# Altium schematic sheet ARDUINO.SchDoc: Arduino UNO connectors
size A4; Author: N.P; CompanyName: STMicroelectronics; Organization: MCD/APPLIS/LMS; DocumentNumber: MB1260; SheetNumber: 12; SheetTotal: 13; Project: STM32F723e-DISCO
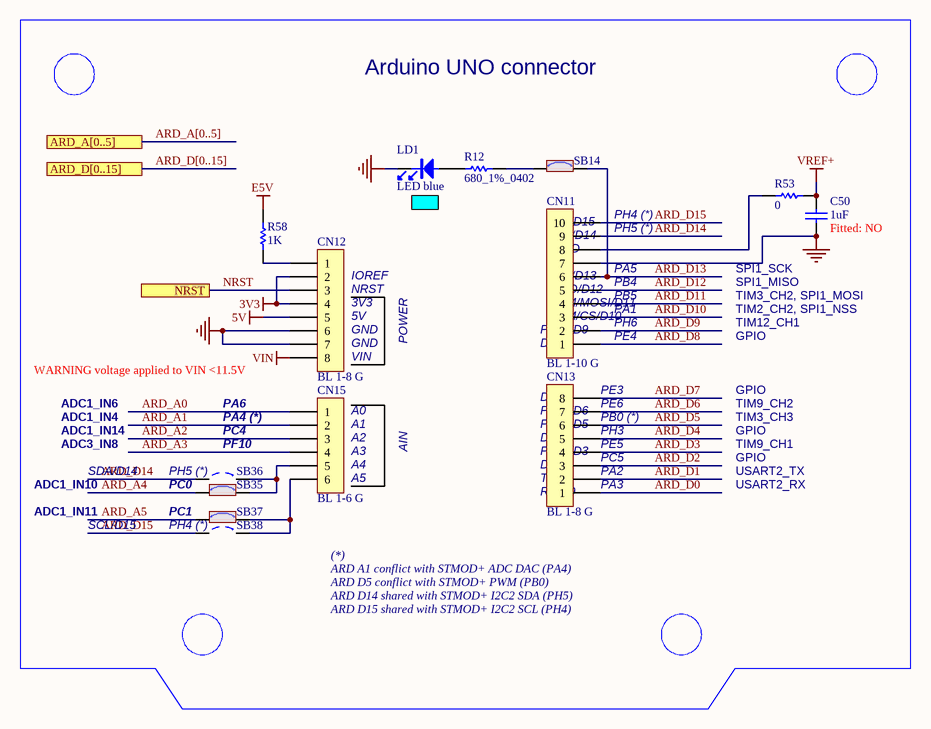
[diagram p0: ARDUINO.SchDoc]

## Parts
C50  1uF  Fitted: NO  [0603C]
CN11  BL 1-10 G  [HDR_1X10_2R54_W]
CN12  BL 1-8 G  [HDR_1X8_2R54_W]
CN13  BL 1-8 G  [HDR_1X8_2R54_W]
CN15  BL 1-6 G  [HDR_1X6_2R54_W]
LD1  LED blue  [0603D]
R12  680_1%_0402  [0402R]
R53  0  [0402R]
R58  1K  [0402R]
SB14  Solder Bridge ON  [JP2_SMD]  (value not drawn)
SB35  Solder Bridge ON  [JP2_SMD]  (value not drawn)
SB36  Solder Bridge OFF  [JP2_SMD]  (value not drawn)
SB37  Solder Bridge ON  [JP2_SMD]  (value not drawn)
SB38  Solder Bridge OFF  [JP2_SMD]  (value not drawn)

## Ports
ARD_A[0..5], ARD_D[0..15], NRST

## Nets
3V3: CN12.2 CN12.4
5V: CN12.5
E5V: R58.2
GND: C50.1 CN11.7 CN12.6 CN12.7 LD1.2
VIN: CN12.8
VREF+: C50.2 R53.2
ARD_A0: CN15.1
ARD_A1: CN15.2
ARD_A2: CN15.3
ARD_A3: CN15.4
ARD_A4: SB35.1
ARD_A5: SB37.1
ARD_D0: CN13.1
ARD_D1: CN13.2
ARD_D2: CN13.3
ARD_D3: CN13.4
ARD_D4: CN13.5
ARD_D5: CN13.6
ARD_D6: CN13.7
ARD_D7: CN13.8
ARD_D8: CN11.1
ARD_D9: CN11.2
ARD_D10: CN11.3
ARD_D11: CN11.4
ARD_D12: CN11.5
ARD_D13: CN11.6 SB14.2
ARD_D14: CN11.9 SB36.1
ARD_D15: CN11.10 SB38.1
NRST: CN12.3 ; port NRST
NetCN11_8: CN11.8 R53.1
NetCN12_1: CN12.1 R58.1
NetCN15_5: CN15.5 SB35.2 SB36.2
NetCN15_6: CN15.6 SB37.2 SB38.2
NetLD1_1: LD1.1 R12.1
NetR12_2: R12.2 SB14.1

## Buses and harness runs
bus ARD_A[0..5] = port ARD_A[0..5]
bus ARD_D[0..15] = port ARD_D[0..15]

## Notes on the sheet
- Arduino UNO connector
- PH4 (*)
- (near CN12) IOREF
- (near CN12) NRST
- (near CN11) SDA/D14
- (near CN11) SCL/D15
- (near CN11) SCK/D13
- (near CN11) MISO/D12
- (near CN11) AVDD
- (near CN11) GND
- (near CN11) PB4
- (near CN11) PA5
- (near CN11) PH5 (*)
- SPI1_MISO
- SPI1_SCK
- (near CN12) 3V3
- (near CN12) 5V
- (near CN12) GND
- POWER
- (near CN11) D8
- (near CN11) PWM/D9
- (near CN11) PWM/CS/D10
- (near CN11) PWM/MOSI/D11
- (near CN11) PA1
- (near CN11) PE4
- (near CN11) PH6
- (near CN11) PB5
- TIM12_CH1
- TIM2_CH2, SPI1_NSS
- TIM3_CH2, SPI1_MOSI
- GPIO
- WARNING voltage applied to VIN <11.5V
- ADC1_IN4
- ADC1_IN6
- PA6
- PA4 (*)
- (near CN15) A0
- (near CN15) A1
- (near CN12) VIN
- (near CN13) PWM/D5
- (near CN13) PWM/D6
- (near CN13) D7
- (near CN13) PE6
- (near CN13) PE3
- (near CN13) PB0 (*)
- TIM3_CH3
- TIM9_CH2
- ADC1_IN10
- ADC3_IN8
- ADC1_IN14
- SDA/D14
- (near SB36) PH5 (*)
- PC0
- PC4
- PF10
- (near CN15) A2
- (near CN15) A3
- (near CN15) A4
- (near CN15) A5
- AIN
- (near CN13) TX/D1
- (near CN13) D2
- (near CN13) D4
- (near CN13) PWM/D3
- (near CN13) PA2
- (near CN13) PC5
- (near CN13) PE5
- (near CN13) PH3
- (near CN13) PA3
- USART2_RX
- USART2_TX
- TIM9_CH1
- ADC1_IN11
- SCL/D15
- PC1
- (near CN13) RX/D0
- (*)
  ARD A1 conflict with STMOD+ ADC DAC (PA4)
  ARD D5 conflict with STMOD+ PWM (PB0)
  ARD D14 shared with STMOD+ I2C2 SDA (PH5)
  ARD D15 shared with STMOD+ I2C2 SCL (PH4)
- Title:
- Project:
- Size:
- Revision:
- Variant:
- -
- Date:
- Reference:
- Sheet:
- of

## Library data of the parts
C50 = Cap_1uF_X5R_10%_0603: Capacitor,1uF,16V,X5R,10%,0603,YAGEO; Manuf_Part_1: CC0603KRX5R7BB105; Ordered by: Subcon; Revision: July-2002: Re-released for DXP Platform.; Value: 1uF; Order: CC0603KRX5R7BB105; Manuf_1: YAGEO; ECCN_US/EU: n/a
CN11 = Header 10X1_Female_THT: Header, 10-Pin, Single row, female, THT, 2.54; Manuf_1: Fischer Electronik; Ordered by: Subcon; Fitted: YES; Manuf_Part_1: BL 1-10 G; Distrib: Sub Co; ECCN_US/EU: n/a
CN12 CN13 = Header 8X1_Female_THT: Header, 8-Pins, Single row, female, THT, 2.54; Manuf_1: Fischer Electronik; Ordered by: Subcon; Fitted: YES; Manuf_Part_1: BL 1-8 G; Distrib: Sub Co; ECCN_US/EU: n/a
CN15 = Header 6X1_Female_THT: Header, 6-Pins, Single row, female THT, 2.54; Manuf_1: Fischer Electronik; Ordered by: Subcon; Fitted: YES; Manuf_Part_1: BL 1-6 G; Distrib: Sub Co; ECCN_US/EU: n/a
LD1 = LED_blue: LED blue 0603; Manuf_1: everlight; Manuf_Part_1: 19-213SUBC/S400-A5/S208-2/S4/TR8; ECCN_US/EU: EAR99/NEC; Fitted: YES; Ordered by: Subcon
R12 = Res_680_1%_0402: Resistor,680,0402,1%,YAGEO; Manuf_Part_1: RC0402FR-07680RL; Manuf_Part_2: RT0402FRE07680RL; Ordered by: Subcon; Fitted: YES; Value: 680; ECCN_US/EU: n/a; Manuf_1: YAGEO; Distrib: FARNELL; Manuf_2: YAGEO
R53 = Res_0_5%_0402: Resistor,0,0402,5%,YAGEO; Manuf_Part_1: RC0402JR-070RL; Order: 2363467; Ordered by: Subcon; Fitted: YES; Value: 0; ECCN_US/EU: n/a; Manuf_1: YAGEO; Distrib: FARNELL
R58 = Res_1K_1%_0402: Resistor,1K,0402,1%,YAGEO; Manuf_Part_1: RC0402FR-071KL; Ordered by: Subcon; Fitted: YES; Value: 1K; Manuf_1: YAGEO; Order: RC0402FR-071KL; ECCN_US/EU: n/a
SB14 SB35 SB37 = SB_ON: Fitted: YES; Ordered by: Subcon; Revision: July-2002: Re-released for DXP Platform.; ECCN_US/EU: n/a
SB36 SB38 = SB_OFF: Fitted: NO; Ordered by: Subcon; Revision: July-2002: Re-released for DXP Platform.; ECCN_US/EU: n/a